# Altium schematic sheet PMP30825_RevB.SchDoc (part 1 of 2)
size 431 x 279 mm; Date: Not shown in title block; ApprovedBy: Not shown in title block; CheckedBy: Not shown in title block; Author: Not shown in title block; CompanyName: Not shown in title block; Engineer: Not shown in title block; Organization: Not shown in title block; Address1: Not shown in title block; Address2: Not shown in title block; Address3: Not shown in title block; Address4: Not shown in title block; DocumentNumber: 1; Revision: Use project parameter SCH_Rev; SheetNumber: 2; SheetTotal: 3; PageSetup: Record=PageOptions|CenterHorizontal=True|CenterVertical=True|PrintScale=1.00|XCorrection=1.00|YCorrection=1.00|PrintKind=0|BorderSize=5000000|LeftOffset=0|BottomOffset=0|Orientation=2|PaperLength=1000|PaperWidth=1000|Scale=100|PaperSource=15|PrintQuality=600|MediaType=1|DitherType=10|PaperKind=Letter|PrintScaleMode=1; CurrentTime: Not shown in title block; CurrentDate: Not shown in title block; Time: Not shown in title block; DocumentFullPathAndName: Not shown in title block; DocumentName: Not shown in title block; ModifiedDate: Not shown in title block; ImagePath: Not shown in title block
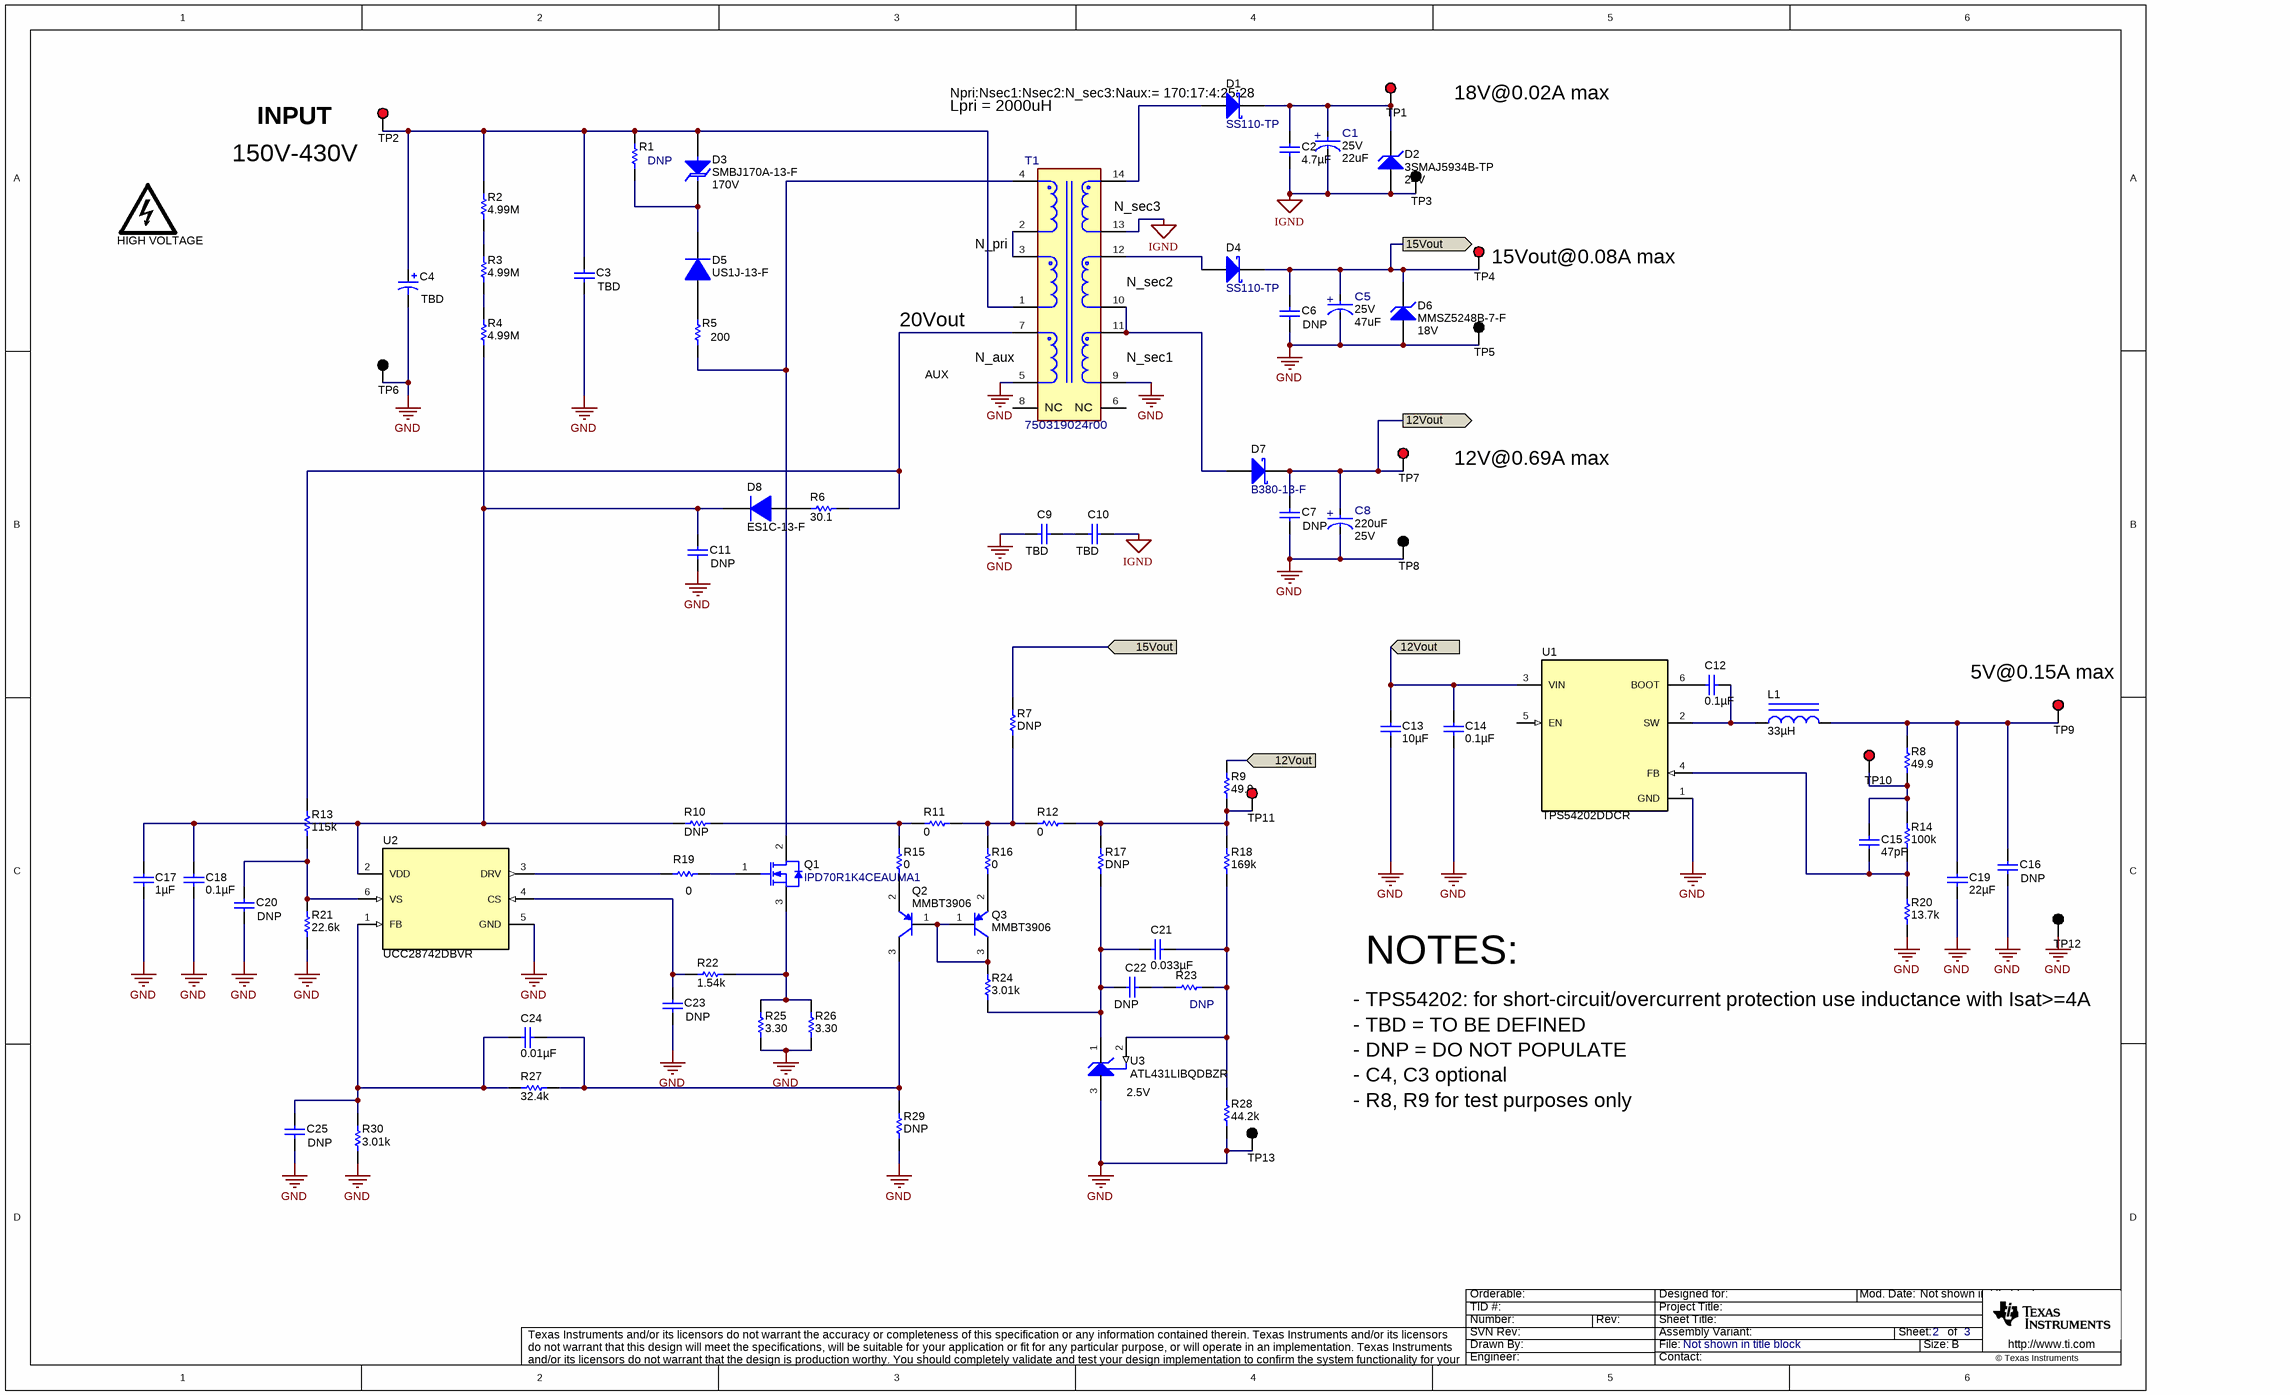
[diagram p0: PMP30825_RevB.SchDoc]

## Parts
C1  VDC_V: 25V  ValueDisplayed: 22uF  [FP-UPW1E220MDD_RADIAL-MFG]  (hidden comment: UPW1E220MDD)
C2  ValueDisplayed: 4.7µF  [1206_180]  (hidden comment: C3216X7R1H475K160AC)
C3  value TBD  [2220]  (hidden comment: 2220Y5000105KXTWS3)
C4  value TBD  [ED_1250x2500]  (hidden comment: EEU-ED2W150)
C5  VDC_V: 25V  ValueDisplayed: 47uF  [FP-25ZLG47MEFC6.3X7_RADIAL-MFG]  (hidden comment: 25ZLG47MEFC6.3X7)
C6  DNP  [1210]
C7  DNP  [1210]
C8  ValueDisplayed: 220uF  VDC_V: 25V  [FP-25AX220MEFC8X9_RADIAL-MFG]  (hidden comment: 25AX220MEFC8X9)
C9  TBD  [KY_1000x500x1300]
C10  TBD  [KY_1000x500x1300]
C11  DNP  [1206]
C12  ValueDisplayed: 0.1µF  [0603]  (hidden comment: GRM188R71H104KA93D)
C13  ValueDisplayed: 10µF  [1206_180]  (hidden comment: GRM31CR71E106KA12L)
C14  ValueDisplayed: 0.1µF  [0603]  (hidden comment: GRM188R71E104KA01D)
C15  ValueDisplayed: 47pF  [0603]  (hidden comment: GRM1885C1H470JA01D)
C16  DNP  [1206]
C17  ValueDisplayed: 1µF  [0805_HV1]  (hidden comment: GRM21BR71H105KA12L)
C18  ValueDisplayed: 0.1µF  [0805_HV1]  (hidden comment: C0805C104J5RACTU)
C19  ValueDisplayed: 22µF  [1206_180]  (hidden comment: GRM31CR71A226KE15L)
C20  value DNP  [0603]  (hidden comment: Used in BOM report)
C21  ValueDisplayed: 0.033µF  [0805_HV]  (hidden comment: 08055C333JAT2A)
C22  DNP  [0805]
C23  value DNP  [0603]  (hidden comment: Used in BOM report)
C24  ValueDisplayed: 0.01µF  [0603]  (hidden comment: C0603X103K5RACTU)
C25  DNP  [0603]
D1  SS110-TP  [SMA]
D2  3SMAJ5934B-TP  value 24V  [SMA]
D3  SMBJ170A-13-F  value 170V  [SMB]
D4  SS110-TP  [SMA]
D5  US1J-13-F  [SMA]
D6  MMSZ5248B-7-F  value 18V  [SOD-123]
D7  B380-13-F  [SMC]
D8  ES1C-13-F  [SMA]
HIGH_VOLTAGE  DANGER HIGH VOLTAGE  [IEC_HighVoltage_Small]  (value not drawn)  (no BOM)
L1  ValueDisplayed: 33µH  [LPS4018]  (hidden comment: LPS4018-333MLB)
Q1  IPD70R1K4CEAUMA1  [DPAK]
Q2  MMBT3906  [SOT-23]
Q3  MMBT3906  [SOT-23]
R1  value DNP  [2512]  (hidden comment: Used in BOM report)
R2  ValueDisplayed: 4.99M  [0805_HV]  (hidden comment: CRCW08054M99FKEA)
R3  ValueDisplayed: 4.99M  [0805_HV]  (hidden comment: CRCW08054M99FKEA)
R4  ValueDisplayed: 4.99M  [0805_HV]  (hidden comment: CRCW08054M99FKEA)
R5  value 200  [2512]  (hidden comment: CRCW2512200RJNEG)
R6  ValueDisplayed: 30.1  [0805_HV]  (hidden comment: CRCW080530R1FKEA)
R7  value DNP  [0603]  (hidden comment: Used in BOM report)
R8  ValueDisplayed: 49.9  [0603]  (hidden comment: CRCW060349R9FKEA)
R9  ValueDisplayed: 49.9  [0603]  (hidden comment: CRCW060349R9FKEA)
R10  value DNP  [0603]  (hidden comment: Used in BOM report)
R11  ValueDisplayed: 0  [0603]  (hidden comment: CRCW06030000Z0EA)
R12  ValueDisplayed: 0  [0603]  (hidden comment: CRCW06030000Z0EA)
R13  ValueDisplayed: 115k  [0603]  (hidden comment: CRCW0603115KFKEA)
R14  ValueDisplayed: 100k  [0603]  (hidden comment: CRCW0603100KFKEA)
R15  ValueDisplayed: 0  [0603]  (hidden comment: CRCW06030000Z0EA)
R16  ValueDisplayed: 0  [0603]  (hidden comment: CRCW06030000Z0EA)
R17  value DNP  [0603]  (hidden comment: Used in BOM report)
R18  ValueDisplayed: 169k  [0603]  (hidden comment: CRCW0603169KFKEA)
R19  ValueDisplayed: 0  [0805_HV]  (hidden comment: CRCW08050000Z0EA)
R20  ValueDisplayed: 13.7k  [0603]  (hidden comment: CRCW060313K7FKEA)
R21  ValueDisplayed: 22.6k  [0603]  (hidden comment: CRCW060322K6FKEA)
R22  ValueDisplayed: 1.54k  [0603]  (hidden comment: CRCW06031K54FKEA)
R23  DNP  [0603]
R24  ValueDisplayed: 3.01k  [0603]  (hidden comment: CRCW06033K01FKEA)
R25  ValueDisplayed: 3.30  [0805_HV]  (hidden comment: ERJ-6RQF3R3V)
R26  ValueDisplayed: 3.30  [0805_HV]  (hidden comment: ERJ-6RQF3R3V)
R27  ValueDisplayed: 32.4k  [0603]  (hidden comment: CRCW060332K4FKEA)
R28  ValueDisplayed: 44.2k  [0603]  (hidden comment: CRCW060344K2FKEA)
R29  value DNP  [0603]  (hidden comment: Used in BOM report)
R30  ValueDisplayed: 3.01k  [0603]  (hidden comment: CRCW06033K01FKEA)
T1  750319024r00  [FP-750319024r00_PTH_TRANSFORMER-MFG]
TP1  5000  [Keystone5000]  (value not drawn)
TP2  5000  [Keystone5000]  (value not drawn)
TP3  5001  [Keystone5001]  (value not drawn)
TP4  5000  [Keystone5000]  (value not drawn)
TP5  5001  [Keystone5001]  (value not drawn)
TP6  5001  [Keystone5001]  (value not drawn)
TP7  5000  [Keystone5000]  (value not drawn)
TP8  5001  [Keystone5001]  (value not drawn)
TP9  5000  [Keystone5000]  (value not drawn)
TP10  5000  [Keystone5000]  (value not drawn)
TP11  5000  [Keystone5000]  (value not drawn)
TP12  5001  [Keystone5001]  (value not drawn)
TP13  5001  [Keystone5001]  (value not drawn)
U1  TPS54202DDCR  [DDC0006A_N]
U2  UCC28742DBVR  [DBV0006A_N]
U3  ATL431LIBQDBZR  [DBZ0003A_N]

## Ports
12Vout (in), 12Vout (out), 15Vout (in), 15Vout (out)

## Nets
GND: C3.2 C4.2(-) C5.1(CATHODE) C6.2 C7.2 C8.1(CATHODE) C9.2 C11.2 C13.2 C14.2 C16.2 C17.2 C18.2 C19.2 C20.2 C23.2 C25.2 D6.2(A) R20.1 R21.1 R25.1 R26.1 R28.1 R29.2 R30.1 T1.5 T1.9 TP5.1 TP6.1 TP8.1 TP12.1 TP13.1 U1.1(GND) U2.5(GND) U3.3(ANODE)
IGND: C1.1(CATHODE) C2.2 C10.1 D2.2(A) T1.13 TP3.1
12Vout: C7.1 C8.2(ANODE) C13.1 C14.1 D7.1(K) R9.2 TP7.1 U1.3(VIN) ; port 12Vout
15Vout: C5.2(ANODE) C6.1 D4.1(K) D6.1(K) R7.1 TP4.1 ; port 15Vout
NetC1_2: C1.2(ANODE) C2.1 D1.1(K) D2.1(K) TP1.1
NetC3_1: C3.1 C4.1(+) D3.2(A) R1.2 R2.2 T1.1 TP2.1
NetC9_1: C9.1 C10.2
NetC11_1: C11.1 C17.1 C18.1 D8.1(K) R4.1 R10.2 U2.2(VDD)
NetC12_1: C12.1 L1.1 U1.2(SW)
NetC12_2: C12.2 U1.6(BOOT)
NetC15_1: C15.1 R8.1 R14.2 TP10.1
NetC15_2: C15.2 R14.1 R20.2 U1.4(FB)
NetC16_1: C16.1 C19.1 L1.2 R8.2 TP9.1
NetC20_1: C20.1 R13.1 R21.2 U2.6(VS)
NetC21_1: C21.1 R18.1 R23.2 R28.2 U3.2(REF)
NetC21_2: C21.2 C22.1 R17.2 R24.1 U3.1(CATHODE)
NetC22_2: C22.2 R23.1
NetC23_1: C23.1 R22.2 U2.4(CS)
NetC24_1: C24.1 C25.1 R27.2 R30.2 U2.1(FB)
NetC24_2: C24.2 Q2.3(C) R27.1 R29.1
NetD1_2: D1.2(A) T1.14
NetD3_1: D3.1(K) D5.1(K) R1.1
NetD4_2: D4.2(A) T1.12
NetD5_2: D5.2(A) R5.2
NetD7_2: D7.2(A) T1.10 T1.11
NetD8_2: D8.2(A) R6.1
NetQ1_1: Q1.1(G) R19.2
NetQ1_2: Q1.2(D) R5.1 T1.4
NetQ1_3: Q1.3(S) R22.1 R25.2 R26.2
NetQ2_1: Q2.1(B) Q3.1(B) Q3.3(C) R24.2
NetQ2_2: Q2.2(E) R15.1
NetQ3_2: Q3.2(E) R16.1
NetR2_1: R2.1 R3.2
NetR3_1: R3.1 R4.2
NetR6_2: R6.2 R13.2 T1.7
NetR7_2: R7.2 R11.1 R12.2 R16.2
NetR9_1: R9.1 R12.1 R17.1 R18.2 TP11.1
NetR10_1: R10.1 R11.2 R15.2
NetR19_1: R19.1 U2.3(DRV)
NetT1_2: T1.2 T1.3

Not connected (* = marked no-connect by the designer): T1 6(NC) 8(NC); U1 5(EN)

## Notes on the sheet
- (near D1) Npri:Nsec1:Nsec2:N_sec3:Naux:= 170:17:4:25:28
- 18V@0.02A max
- INPUT
- Lpri = 2000uH
- (near TP2) 150V-430V
- (near T1) N_sec3
- (near T1) N_pri
- (near T1) N_sec2
- (near TP4) 15Vout@0.08A max
- 20Vout
- AUX
- (near T1) N_aux
- (near T1) N_sec1
- 12V@0.69A max
- (near TP9) 5V@0.15A max
- NOTES:
- - TPS54202: for short-circuit/overcurrent protection use inductance with Isat>=4A
- - TBD = TO BE DEFINED
- (near U3) 2.5V
- - C4, C3 optional
- - DNP = DO NOT POPULATE
- - R8, R9 for test purposes only
- Drawn By:
- SVN Rev:
- Number:
- TID #:
- Orderable:
- Rev:
- Sheet Title:
- File:
- Project Title:
- Designed for:
- Assembly Variant:
- Mod. Date:
- Sheet:
- Size:
- of
- B
- http://www.ti.com
- Texas Instruments and/or its licensors do not warrant the accuracy or completeness of this specification or any information contained therein. Texas Instruments and/or its licensors do not warrant that this design will meet the specifications, will be suitable for your application or fit for any particular purpose, or will operate in an implementation. Texas Instruments and/or its licensors do not warrant that the design is production worthy. You should completely validate and test your design implementation to confirm the system functionality for your application.
- Engineer:
- Contact:
- © Texas Instruments
- (in symbol CMP-0088537-1) +
- (in symbol CMP-0088544-1) +
- (in symbol CMP-0088565-1) +